# EAGLE design TRACKING_IF (EAGLE 6.5.0)
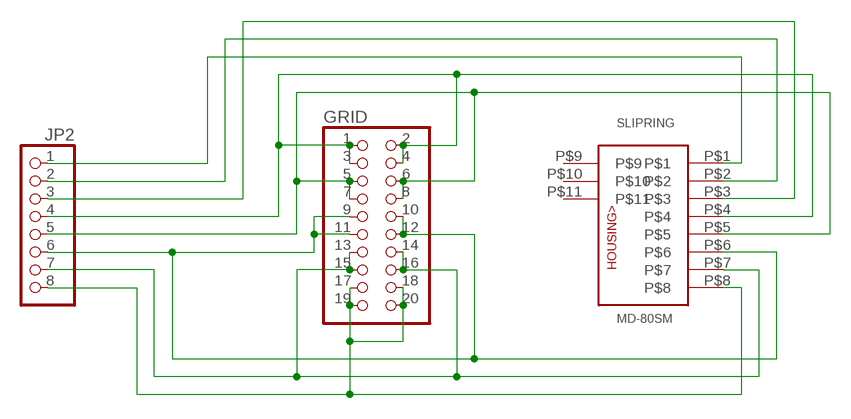
[diagram p0: schematic, sheet 1]

## Parts
GRID  PINHD-2X10  [2X10]
JP2  PINHD-1X8  [1X08]
SLIPRING  MD-80SM  [MINIDIN8PCB]

## Nets
N$1: GRID.1 GRID.2 GRID.3 GRID.4 JP2.4 SLIPRING.P$4
N$2: JP2.2 SLIPRING.P$2
N$3: GRID.5 GRID.6 GRID.7 GRID.8 JP2.5 SLIPRING.P$5
N$4: GRID.17 GRID.18 GRID.19 GRID.20 JP2.8 SLIPRING.P$8
N$11: JP2.1 SLIPRING.P$1
N$12: JP2.3 SLIPRING.P$3
N$14: GRID.9 GRID.10 GRID.11 GRID.12 JP2.6 SLIPRING.P$6
N$17: GRID.13 GRID.14 GRID.15 GRID.16 JP2.7 SLIPRING.P$7
Unconnected: SLIPRING.P$9 SLIPRING.P$10 SLIPRING.P$11

## Library data of the parts
GRID = pinhead:PINHD-2X10: PIN HEADER
JP2 = pinhead:PINHD-1X8: PIN HEADER
SLIPRING = mydin:MD-80SM: MD-80SM RIGHT ANGLE MINI DIN PCB TH CONNECTOR

## Board
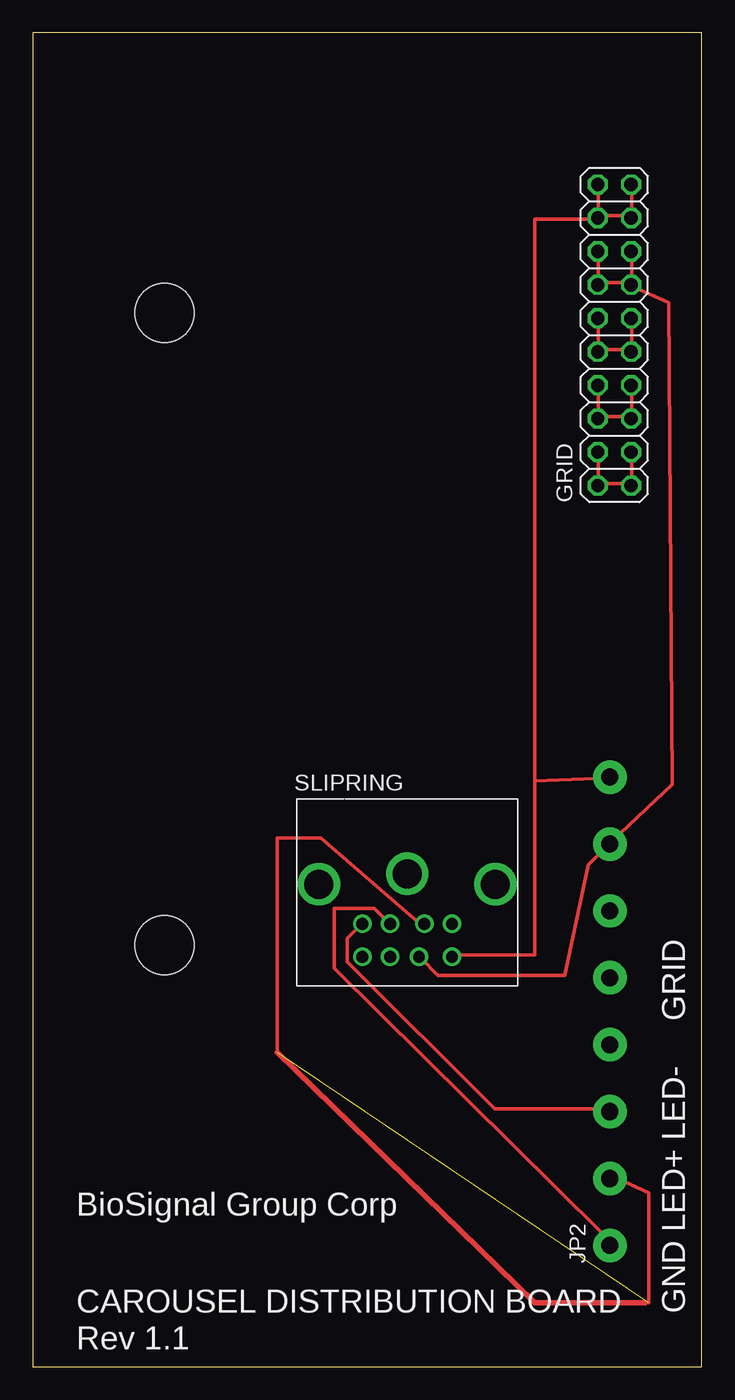
[diagram p1: board, top side]
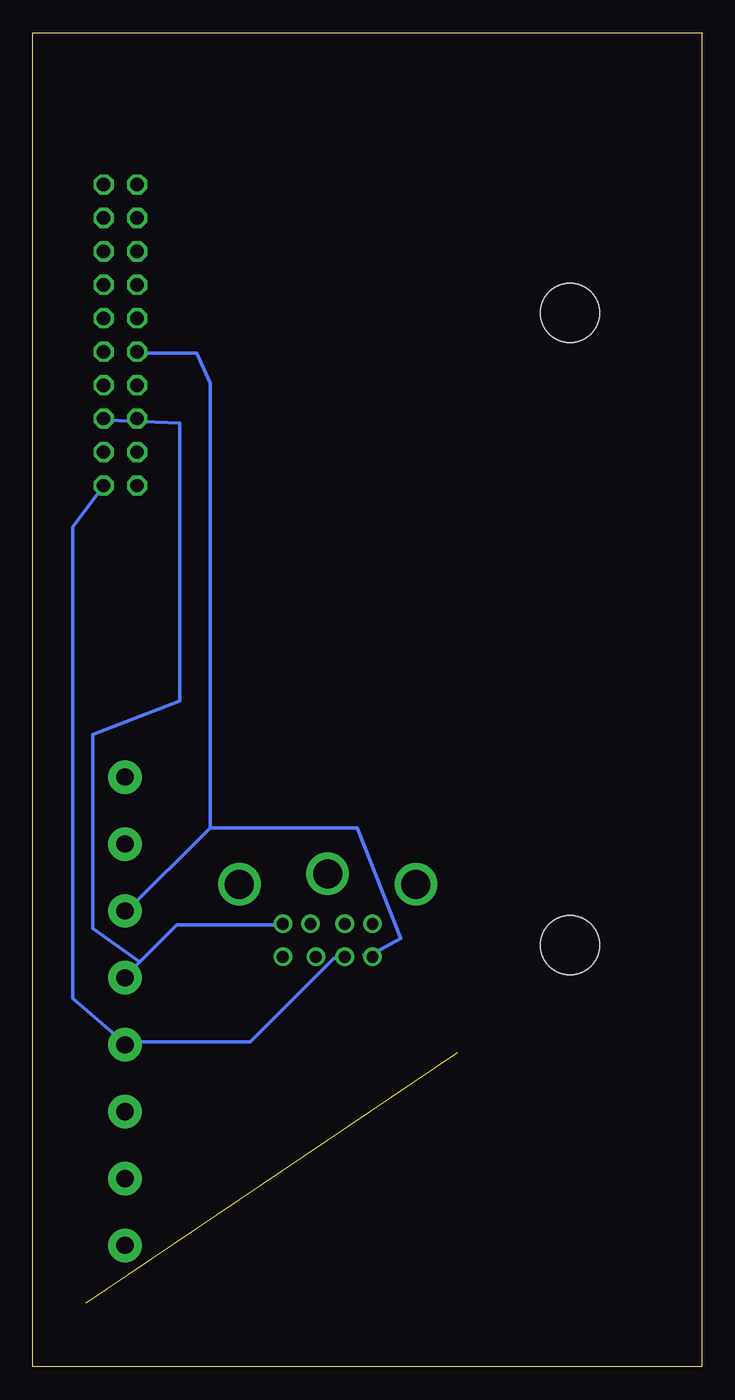
[diagram p2: board, bottom side, seen from below]

Size 50.78 x 101.27 mm. Coordinates in mm from the lower left corner, seen from the top.
Outline: 0,0 50.78,0 50.78,101.27 0,101.27 0,0
Copper layers (1*16): Top 0.035mm / dielectric 1.5mm / Bottom 0.035mm
Design rules "default": minimum track width 10mil, minimum drill 24mil, track to track 8mil, track to pad 8mil, pad to pad 8mil, via to via 8mil, smd to smd 8mil, copper to edge 40mil, drill to drill 8mil, minimum pad ring 10mil, minimum via ring 8mil, stop-mask expansion 4mil, vias tented up to drill 0mil, thermal gap 10mil
Holes 4.5 mm at 10,80 10,32

### Footprints (pad centres in the part's own frame; a part is rotated, then mirrored left to right if it is on the bottom)
2X10 = drill 1.016 octagon: 1 -11.43,-1.27; 2 -11.43,1.27; 3 -8.89,-1.27; 4 -8.89,1.27; 5 -6.35,-1.27; 6 -6.35,1.27; 7 -3.81,-1.27; 8 -3.81,1.27; 9 -1.27,-1.27; 10 -1.27,1.27; 11 1.27,-1.27; 12 1.27,1.27; 13 3.81,-1.27; 14 3.81,1.27; 15 6.35,-1.27; 16 6.35,1.27; 17 8.89,-1.27; 18 8.89,1.27; 19 11.43,-1.27; 20 11.43,1.27
1X08 = drill 1.3 pad 2.54: 1 -8.89,0; 2 -3.81,0; 3 1.27,0; 4 6.35,0; 5 11.43,0; 6 16.51,0; 7 21.59,0; 8 26.67,0
MINIDIN8PCB = drill 0.9: P$1 -1.3,0; P$2 1.3,0; P$3 -3.4,0; P$4 -1.3,-2.5; P$5 3.4,0; P$6 -3.4,-2.5; P$7 0.9,-2.5; P$8 3.4,-2.5 | drill 2.2: P$9 -6.7,3; P$10 6.7,3; P$11 0,3.8

### Placement (x,y rotation side)
GRID  44.14,78.33 90 top
JP2  43.79,18.09 90 top
SLIPRING  28.41,33.62 0 top

### Tracks (layer width: path | path; a pad name or v marks a point on that pad's centre or on a via)
N$1
  Top 0.254: 42.93,67.06 42.93,69.34 GRID.4 | GRID.3 45.47,69.34 45.47,67.06 GRID.1 45.21,67.06 42.93,67.06 | 42.93,67.06 GRID.2
  Bottom 0.254: SLIPRING.P$4 27.18,30.99 27.94,30.99 34.29,24.64 43.69,24.64 JP2.4 43.94,24.64 47.75,27.94 47.75,63.75 GRID.1
N$2  (1 unrouted)
  Top 0.254: 18.54,23.88 18.54,40.13 21.84,40.13 29.46,33.53 SLIPRING.P$2 | 46.74,4.83 46.74,13.21 43.94,14.48 JP2.2
  Top 0.406: 46.48,4.83 38.1,4.83 18.54,23.88
N$3
  Top 0.254: GRID.7 45.47,74.42 45.47,72.14 GRID.5 45.21,72.14 42.93,72.14 | 42.93,72.14 42.93,74.42 GRID.8 | 42.93,72.14 GRID.6
  Bottom 0.254: 43.94,29.72 JP2.5 43.69,29.72 42.67,30.73 | 42.67,30.73 39.88,33.53 32,33.53 SLIPRING.P$5 | 42.67,30.73 46.23,33.27 46.23,48.01 39.62,50.55 39.62,71.63 45.21,71.88 GRID.5
N$4
  Top 0.254: 42.93,87.38 42.93,89.66 GRID.20 | GRID.19 45.47,89.66 45.47,87.38 GRID.17 45.21,87.38 42.93,87.38 | 42.93,87.38 GRID.18 42.67,87.12 38.1,87.12 38.1,44.45 | 38.1,44.45 38.1,31.24 32,31.24 SLIPRING.P$8 | 38.1,44.45 43.69,44.7 JP2.8
N$11
  Top 0.254: SLIPRING.P$1 26.92,33.78 25.91,34.8 22.86,34.8 22.86,30.23 43.18,10.16 JP2.1
N$12
  Top 0.254: SLIPRING.P$3 24.89,33.53 23.88,32.51 23.88,30.73 35.05,19.56 43.69,19.56 JP2.3
N$14
  Top 0.254: 42.93,77.22 42.93,79.5 GRID.12 | 42.93,77.22 45.21,77.22 GRID.9 45.47,77.22 45.47,79.5 GRID.11 | 42.93,77.22 GRID.10
  Bottom 0.254: 43.18,77.47 GRID.10 42.67,76.96 38.35,76.96 37.34,74.68 37.34,40.89 | 25.65,31.24 25.15,31.24 | 25.15,31.24 22.86,32.51 26.16,40.89 37.34,40.89 | 37.34,40.89 43.69,34.54 JP2.6 | 25.15,31.24 SLIPRING.P$6
N$17
  Top 0.254: GRID.13 45.47,82.3 45.47,84.58 GRID.15 | 42.93,82.3 42.93,84.58 GRID.16 | 42.93,82.3 45.21,82.3 GRID.13 | 42.93,82.3 GRID.14 | SLIPRING.P$7 29.46,30.99 30.73,29.72 40.39,29.72 42.16,38.1 43.69,39.62 JP2.7 43.94,39.88 48.51,44.2 48.26,80.77 45.47,82.04 GRID.13

### Text on the board
tPlace: BioSignal Group Corp | CAROUSEL DISTRIBUTION BOARD | GND LED+ LED- GRID | Rev 1.1